# EAGLE design ai_charger_lipo (EAGLE 7.1.0)
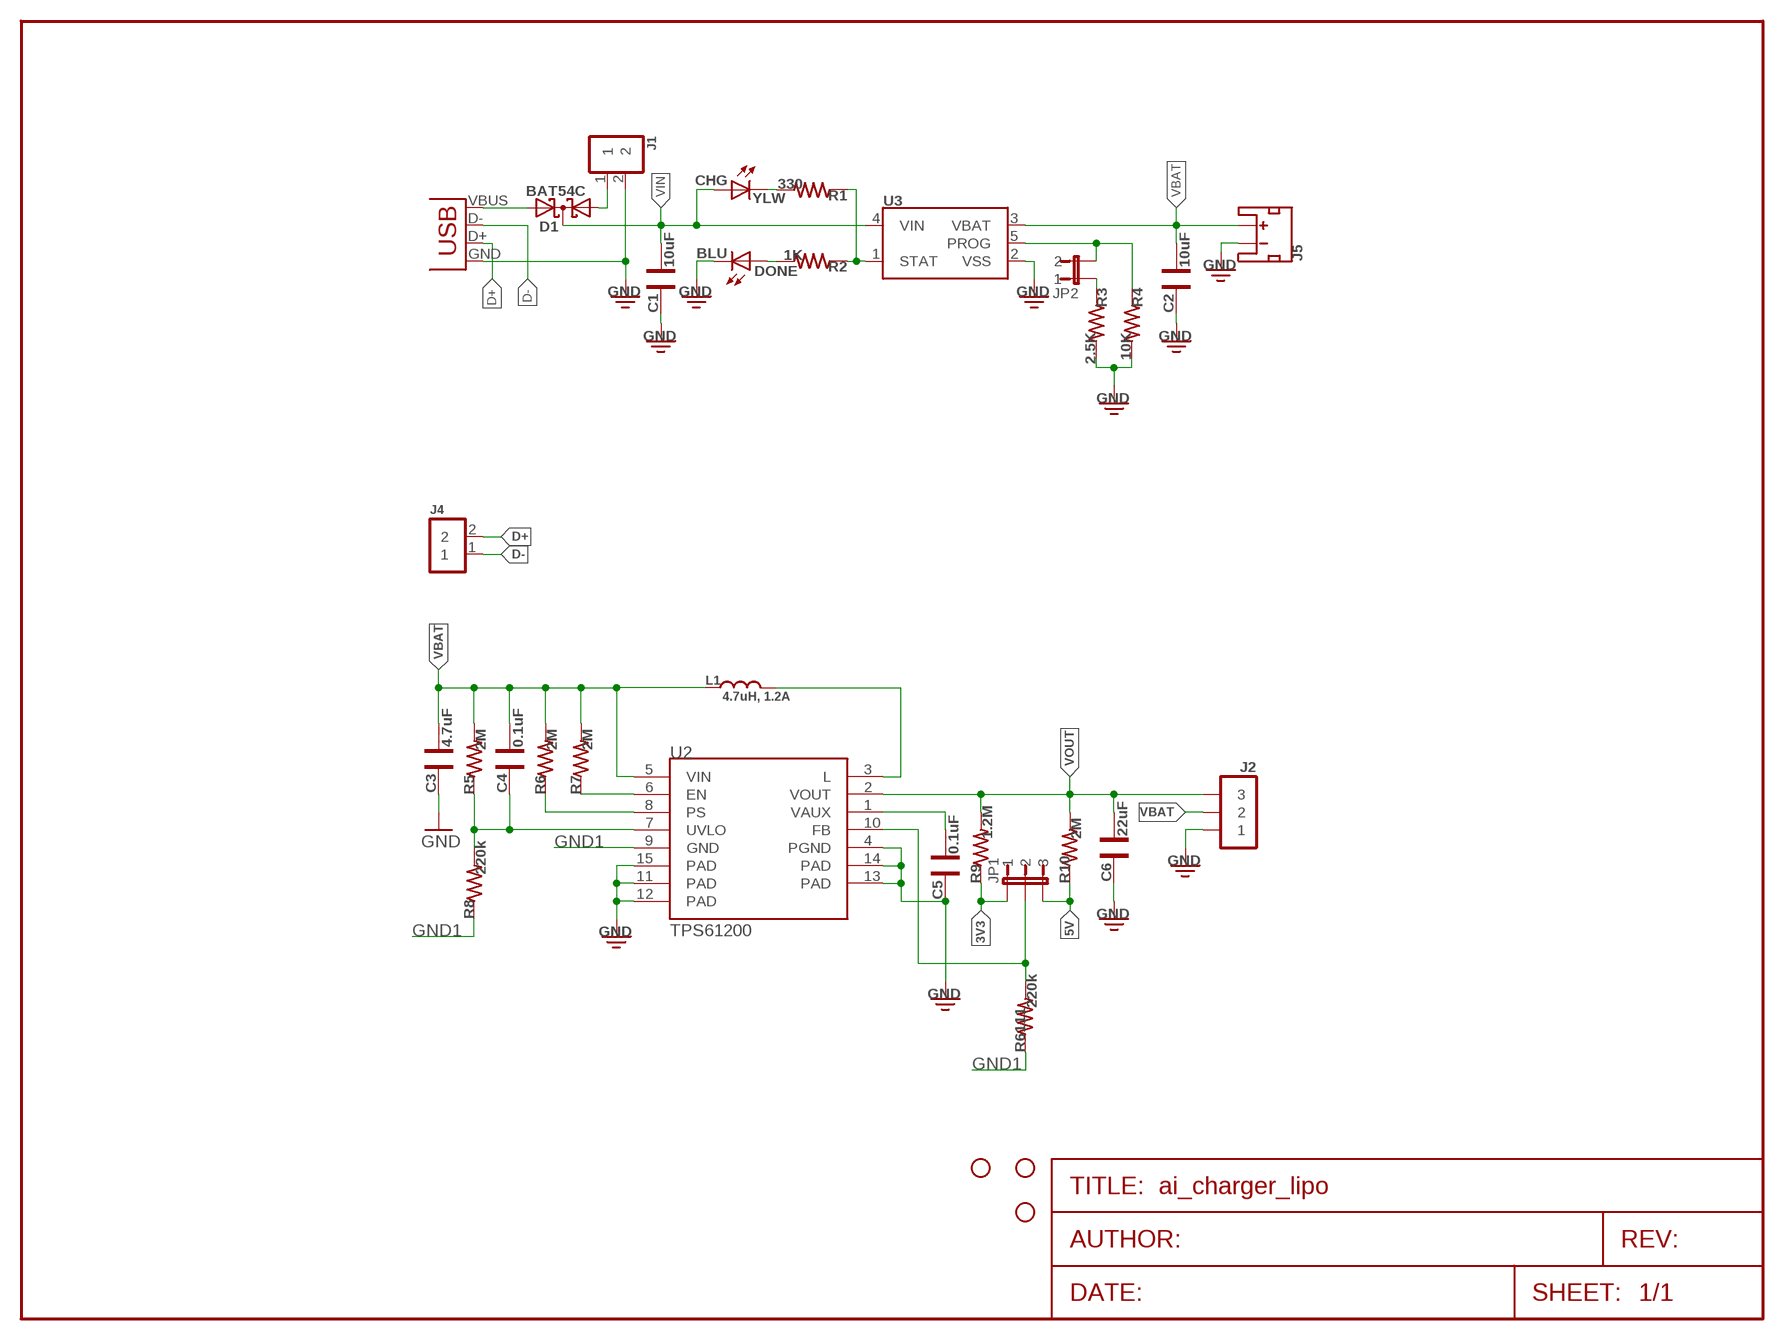
[diagram p0: schematic, sheet 1]

## Parts
C1  10uF  CAP0603  [CAP-0603]
C2  10uF  CAP0603  [CAP-0603]
C3  4.7uF  CAP0603  [CAP-0603]
C4  0.1uF  CAP0603  [CAP-0603]
C5  0.1uF  CAP0603  [CAP-0603]
C6  22uF  CAP0603  [CAP-0603]
CHG  YLW  LED0603  [LED-0603]
D1  BAT54C  [SOT-23]
DONE  BLU  LED0603  [LED-0603]
J1  1X02ST  [1X02-ST]
J2  1X03NOFIRST  [1X03-NOFIRST]
J4  1X02NOFIRST  [1X02-NOFIRST]
J5  JST-2-MALE  [JST-2-SMD]
JP1  1X03-PJNOFIRST  [1X03-NOFIRST]
JP2  1X02-PJNOFIRST  [1X02-NOFIRST]
L1  4.7uH, 1.2A  IND0603  [IND-0603]
R1  330  RES0603  [RES-0603]
R2  1K  RES0603  [RES-0603]
R3  2.5K  RES0603  [RES-0603]
R4  10K  RES0603  [RES-0603]
R5  2M  RES0603  [RES-0603]
R6  2M  RES0603  [RES-0603]
R7  2M  RES0603  [RES-0603]
R8  220k  RES0603  [RES-0603]
R9  1.2M  RES0603  [RES-0603]
R10  2M  RES0603  [RES-0603]
R6111  220k  RES0603  [RES-0603]
STANDOFF1  STAND-OFF  [STAND-OFF]
STANDOFF2  STAND-OFF  [STAND-OFF]
STANDOFF3  STAND-OFF  [STAND-OFF]
U2  TPS61200  [QFN-10_PAD]
U3  MCP73831  [SOT23-5]
X2  USBMICROB-TH  [USB-MICROB-TH]

## Nets
3V3: JP1.1 R9.1
5V: JP1.3 R10.1
-: J5.2(-) ; supply symbol labelled GND
D+: J4.2 X2.D+
D-: J4.1 X2.D-
EN: R7.1 U2.6(EN)
FB: JP1.2 R6111.2 U2.10(FB)
GND: C1.2 C2.2 C3.2 C5.2 C6.2 DONE.C J1.2 J2.1 R3.2 R4.2 U2.4(PGND) U2.11(PAD) U2.12(PAD) U2.13(PAD) U2.14(PAD) U2.15(PAD) U3.2(VSS) X2.GND
GND1: R8.1 R6111.1 U2.9(GND)
N$1: C5.1 U2.1(VAUX)
N$2: L1.1 U2.3(L)
N$3: JP2.2 R4.1 U3.5(PROG)
N$4: R1.1 R2.1 U3.1(STAT)
N$5: CHG.C R1.2
N$6: D1.1(A1) J1.1
N$7: D1.2(A2) X2.VBUS
N$9: DONE.A R2.2
N$10: JP2.1 R3.1
PS: R6.1 U2.8(PS)
UVLO: C4.2 R5.1 R8.2 U2.7(UVLO)
VBAT: C2.1 C3.1 C4.1 J2.2 J5.1(+) L1.2 R5.2 R6.2 R7.2 U2.5(VIN) U3.3(VBAT)
VIN: C1.1 CHG.A D1.3(CC) U3.4(VIN)
VOUT: C6.1 J2.3 R9.2 R10.2 U2.2(VOUT)

## Library data of the parts
C1-C6 = Ai_Passives:CAP
CHG DONE = Ai_LED:LED
D1 = Ai_DiscreteSemis:BAT54C: Schottky Diodes Source: Fairchild .. BAT54.pdf
J1 J4 = Ai_Connectors:1X02
J2 = Ai_Connectors:1X03
J5 = Ai_Connectors:JST-2-MALE
JP1 = Ai_Connectors:1X03-PJ
JP2 = Ai_Connectors:1X02-PJ
L1 = Ai_Passives:IND
R1-R10 R6111 = Ai_Passives:RES: Part # blah Digikey
STANDOFF1-STANDOFF3 = Ai_Electromechanical:STAND-OFF: #4 Stand Off This is the mechanical footprint for a #4 phillips button head screw. Use the keepout ring to avoid running the screw head into surrounding components.
U2 = SparkFun:TPS61200: DC to DC Booster
U3 = Ai_IC:MCP73831
X2 = Ai_Connectors:USB

## Board
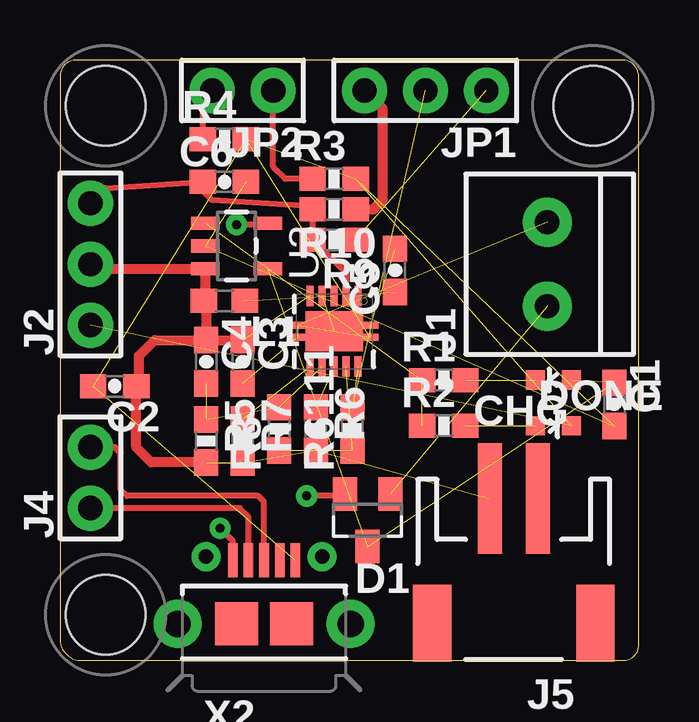
[diagram p1: board, top side]
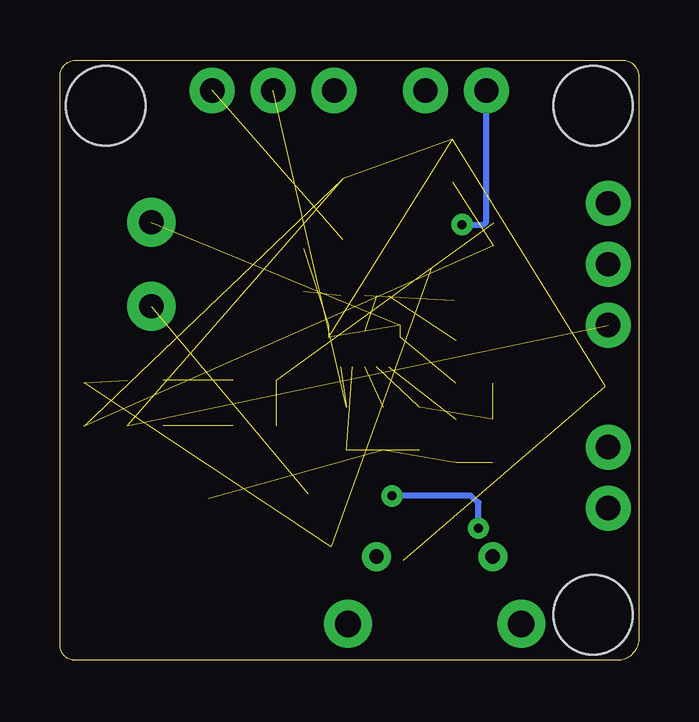
[diagram p2: board, bottom side, seen from below]

Size 24.13 x 25.02 mm. Coordinates in mm from the lower left corner, seen from the top.
Outline: 23.45,25.02 0.68,25.02 arc90 0,24.34 0,0.9 arc90 0.9,0 23.5,0 arc90 24.13,0.64 24.13,24.34 arc90 23.45,25.02
Copper layers (1*16): Top 0.035mm / dielectric 1.5mm / Bottom 0.035mm
Design rules "ai_2layer": minimum track width 7mil, minimum drill 15mil, track to track 8mil, track to pad 8mil, pad to pad 8mil, via to via 8mil, smd to smd 8mil, copper to edge 8mil, drill to drill 8mil, minimum pad ring 12mil, minimum via ring 10mil, stop-mask expansion 4mil, vias tented up to drill 20mil, thermal gap 10mil

### Footprints (pad centres in the part's own frame; a part is rotated, then mirrored left to right if it is on the bottom)
CAP-0603 = smd 1.1 x 1: 1 -0.9,0; 2 0.9,0
LED-0603 = smd 0.8 x 0.8: A 0,-0.75; C 0,0.75
SOT-23 = smd 1 x 1.4: 1 -0.95,-1.1; 2 0.95,-1.1; 3 0,1.1
1X02-ST = drill 1.016 pad 2.032: 1 -1.75,0; 2 1.75,0
1X03-NOFIRST = drill 1.016 pad 1.88: 1 -2.54,0; 2 0,0; 3 2.54,0
1X02-NOFIRST = drill 1.016 pad 1.88: 1 -1.27,0; 2 1.27,0
JST-2-SMD = smd 1 x 4.6: 1 1,-3.7; 2 -1,-3.7 | smd 1.6 x 3.2: NC1 -3.4,1.5; NC2 3.4,1.5
IND-0603 = smd 1.1 x 1: 1 -0.85,0; 2 0.85,0
RES-0603 = smd 1.1 x 1: 1 -0.9,0; 2 0.9,0
STAND-OFF = hole 3.302: 0,0
QFN-10_PAD = smd 0.297 x 0.85: 1 -1,-1.475; 2 -0.5,-1.475; 3 0,-1.475; 4 0.5,-1.475; 5 1,-1.475; 6 1,1.475; 7 0.5,1.475; 8 0,1.475; 9 -0.5,1.475; 10 -1,1.475 | smd 0.7 x 0.28: 11 -1.5,0.25; 12 -1.5,-0.25; 13 1.5,0.25; 14 1.5,-0.25 | smd 2.4 x 1.65: 15 0,0
SOT23-5 = smd 0.55 x 1.2: 1 -0.95,-1.3; 2 0,-1.3; 3 0.95,-1.3; 4 0.95,1.3; 5 -0.95,1.3
USB-MICROB-TH = smd 0.4 x 1.4: D+ 0,2.65; D- -0.65,2.65; GND 1.3,2.65; ID 0.65,2.65; VBUS -1.3,2.65 | smd 1.8 x 1.8: M5 -1.15,0; M6 1.15,0 | drill 0.6 pad 1.2: MT1 -2.425,2.8; MT2 2.425,2.8 | drill 1.1 pad 2: MT3 -3.61,0; MT4 3.61,0

### Placement (x,y rotation side)
C1  23.11,10.67 270 top
C2  2.29,11.43 180 top
C3  7.62,12.45 270 top
C4  6.1,12.45 270 top
C5  13.97,16.26 90 top
C6  6.86,19.94 0 top
CHG  20.57,11.68 90 top
D1  12.83,5.84 180 top
DONE  20.57,9.78 270 top
J1  20.32,16.51 90 top
J2  1.27,16.51 90 top
J4  1.27,7.62 90 top
J5  18.92,3.05 180 top
JP1  15.24,23.75 180 top
JP2  7.62,23.75 180 top
L1  6.86,14.99 180 top
R1  16,11.68 0 top
R2  16,9.78 0 top
R3  11.43,20.07 0 top
R4  6.86,21.72 0 top
R5  6.1,9.14 270 top
R6  10.67,9.65 270 top
R7  7.62,9.14 270 top
R8  9.14,9.65 90 top
R9  11.43,17.53 180 top
R10  11.43,18.8 180 top
R6111  12.19,9.65 90 top
STANDOFF1  1.91,23.11 0 top
STANDOFF2  22.23,23.11 0 top
STANDOFF3  1.91,1.91 0 top
U2  11.43,13.72 180 top
U3  7.37,17.27 270 top
X2  8.51,1.52 0 top

### Tracks (layer width: path | path; a pad name or v marks a point on that pad's centre or on a via)
3V3  (1 unrouted)
5V
  Top 0.406: R10.1 13.08,18.8 13.46,19.18 13.46,22.99 JP1.3
D+
  Top 0.254: X2.D+ 8.51,6.6 8.26,6.86 2.79,6.86 2.54,7.11 2.54,8.64 2.29,8.89 J4.2
D-
  Top 0.254: X2.D- 7.86,5.98 7.49,6.35 J4.1
EN  (1 unrouted)
FB  (2 unrouted)
GND  (17 unrouted)
GND1  (2 unrouted)
N$1  (1 unrouted)
N$2  (1 unrouted)
N$3  (via drill 0.38)
  Top 0.254: JP2.2 5.96,23.36 R4.1 | U3.5 8.61,18.16 v7.37,18.16
  Bottom 0.254: v7.37,18.16 6.48,18.16 6.35,18.29 JP2.2
N$4  (2 unrouted)
N$5  (1 unrouted)
N$6  (1 unrouted)
N$7  (via drill 0.38)
  Top 0.254: X2.VBUS 7.21,4.96 v6.68,5.51 | D1.2 11.79,6.86 v10.29,6.86
  Bottom 0.254: v6.68,5.51 6.68,6.58 6.99,6.86 v10.29,6.86
N$9  (1 unrouted)
N$10
  Top 0.254: R3.1 9.4,20.07 8.89,20.57 JP2.1
PS  (1 unrouted)
UVLO  (3 unrouted)
VBAT  (4 unrouted)
  Top 0.406: J2.2 1.46,16.32 U3.3 6.07,15.04 L1.2 6.1,14.9 C4.1 | R5.2 6.08,8.26 3.81,8.26 3.19,8.88 C2.1 3.3,11.55 3.3,12.7 3.95,13.35 C4.1 | C4.1 C3.1
VIN  (3 unrouted)
VOUT
  Top 0.254: J2.3 1.91,19.68 C6.1 5.96,19.57 6.35,19.18 10.4,18.92 R10.2 R9.2 10.54,17.53 11.94,16.13 U2.2